# EAGLE design Sch_v6 (EAGLE 9.6.2)
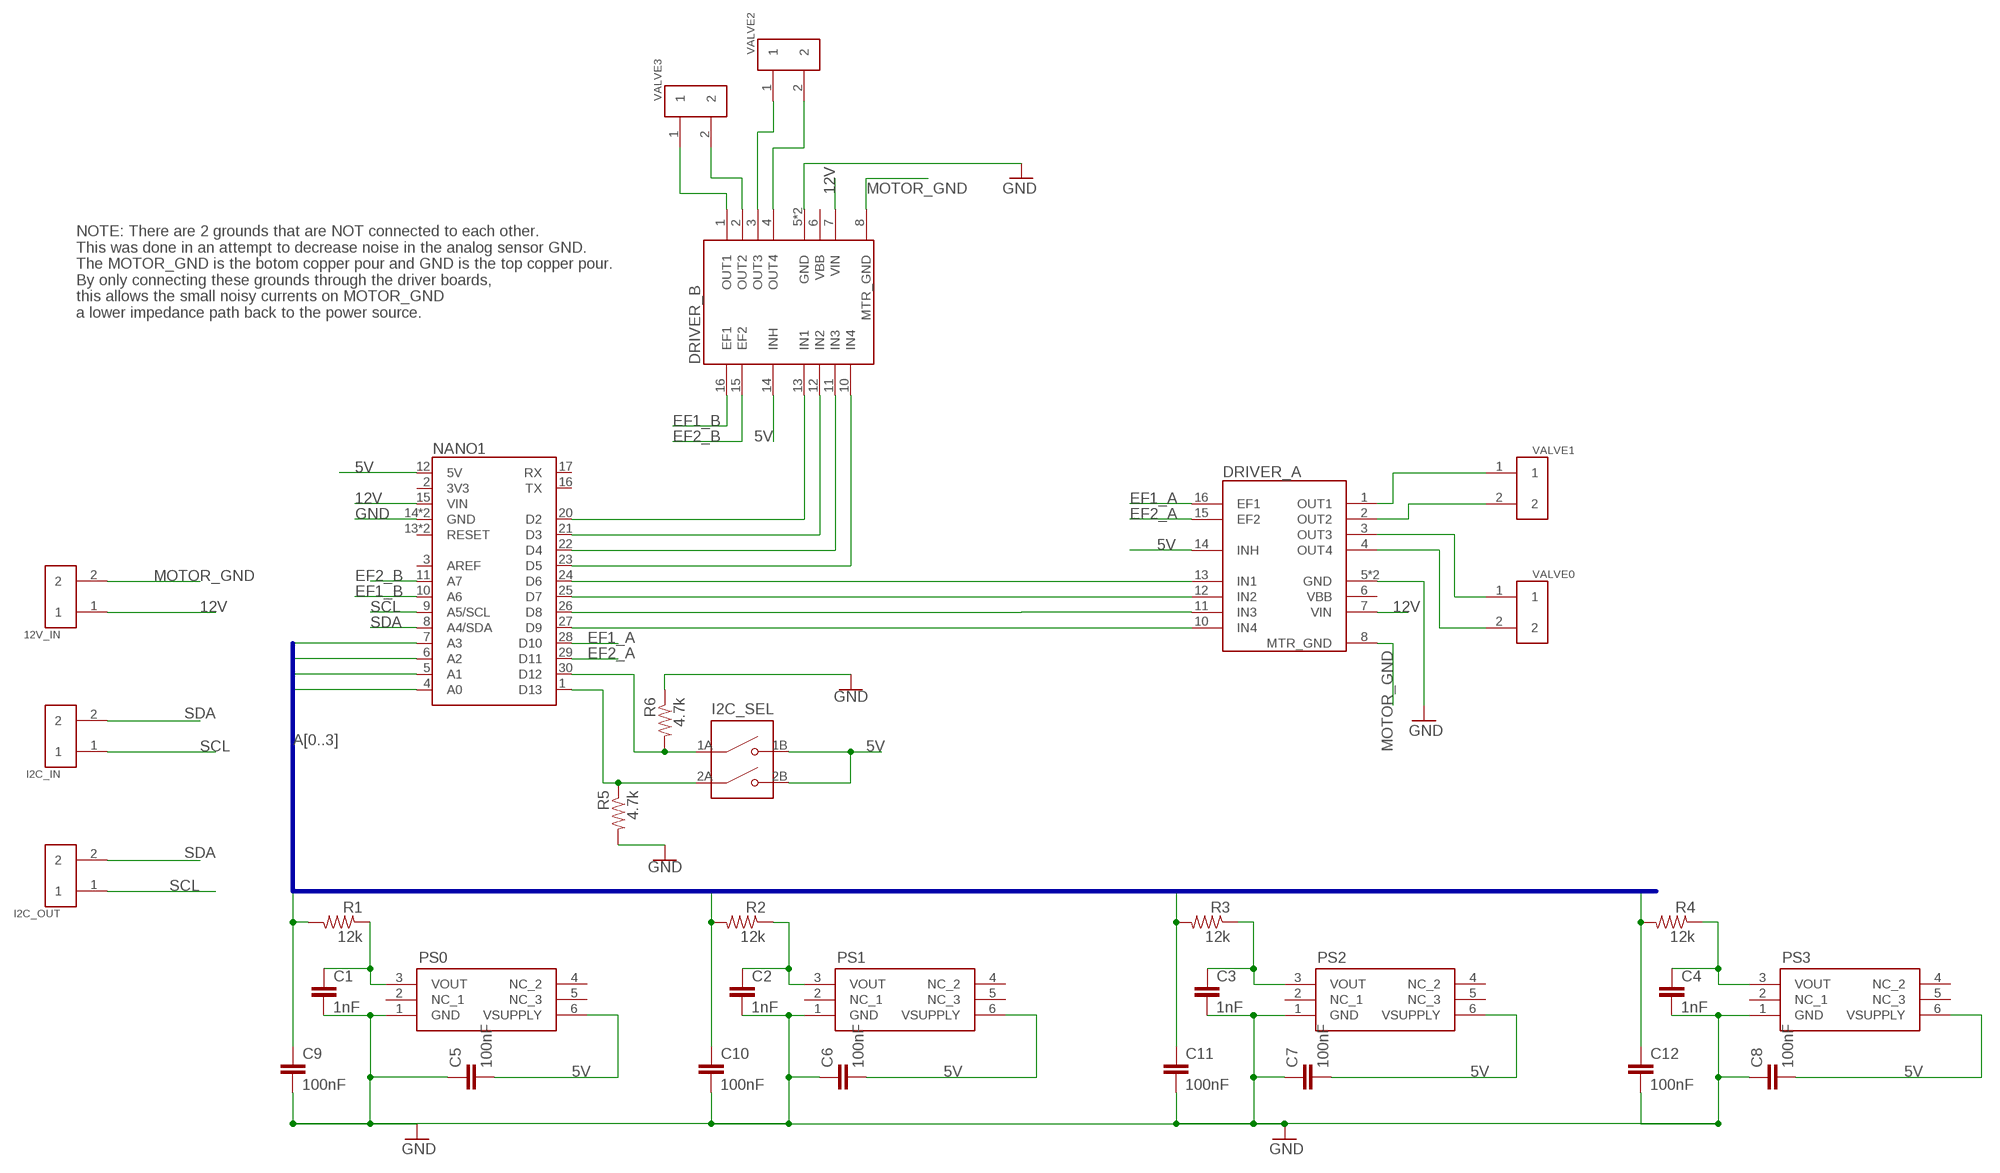
[diagram p0: schematic, sheet 1]

## Parts
12V_IN  PHOENIX_CONTACT_1759017  [PHOENIX_CONTACT_1759017]
C1  1nF  CERAMIC_CAPACITOR  [CERAMIC_CAPACITOR]
C2  1nF  CERAMIC_CAPACITOR  [CERAMIC_CAPACITOR]
C3  1nF  CERAMIC_CAPACITOR  [CERAMIC_CAPACITOR]
C4  1nF  CERAMIC_CAPACITOR  [CERAMIC_CAPACITOR]
C5  100nF  CERAMIC_CAPACITOR  [CERAMIC_CAPACITOR]
C6  100nF  CERAMIC_CAPACITOR  [CERAMIC_CAPACITOR]
C7  100nF  CERAMIC_CAPACITOR  [CERAMIC_CAPACITOR]
C8  100nF  CERAMIC_CAPACITOR  [CERAMIC_CAPACITOR]
C9  100nF  CERAMIC_CAPACITOR  [CERAMIC_CAPACITOR]
C10  100nF  CERAMIC_CAPACITOR  [CERAMIC_CAPACITOR]
C11  100nF  CERAMIC_CAPACITOR  [CERAMIC_CAPACITOR]
C12  100nF  CERAMIC_CAPACITOR  [CERAMIC_CAPACITOR]
DRIVER_A  A4990_DUAL_MOTOR_DRIVER_CARRIER  [A4990_DUAL_MOTOR_DRIVER_CARRIER]
DRIVER_B  A4990_DUAL_MOTOR_DRIVER_CARRIER  [A4990_DUAL_MOTOR_DRIVER_CARRIER]
I2C_IN  PHOENIX_CONTACT_1759017  [PHOENIX_CONTACT_1759017]
I2C_OUT  PHOENIX_CONTACT_1759017  [PHOENIX_CONTACT_1759017]
I2C_SEL  2PIN_DIP_DS01-254-S-02BE  [2PIN_DIP_DS01-254-S-02BE]
NANO1  ARDUINO_NANO_EVERY  [ARDUINO_NANO_EVERY]
PS0  PRESSURE_SENSOR_ABPDRNN100PGAA5  [PRESSURE_SENSOR_ABPDRNN100PGAA5]
PS1  PRESSURE_SENSOR_ABPDRNN100PGAA5  [PRESSURE_SENSOR_ABPDRNN100PGAA5]
PS2  PRESSURE_SENSOR_ABPDRNN100PGAA5  [PRESSURE_SENSOR_ABPDRNN100PGAA5]
PS3  PRESSURE_SENSOR_ABPDRNN100PGAA5  [PRESSURE_SENSOR_ABPDRNN100PGAA5]
R1  12k  R-US_0204/7  [0204/7]
R2  12k  R-US_0204/7  [0204/7]
R3  12k  R-US_0204/7  [0204/7]
R4  12k  R-US_0204/7  [0204/7]
R5  4.7k  R-US_0204/7  [0204/7]
R6  4.7k  R-US_0204/7  [0204/7]
VALVE0  PHOENIX_CONTACT_1759017  [PHOENIX_CONTACT_1759017]
VALVE1  PHOENIX_CONTACT_1759017  [PHOENIX_CONTACT_1759017]
VALVE2  PHOENIX_CONTACT_1759017  [PHOENIX_CONTACT_1759017]
VALVE3  PHOENIX_CONTACT_1759017  [PHOENIX_CONTACT_1759017]

## Nets
5V [Power]: C5.2 C6.2 C7.2 C8.2 DRIVER_A.14(INH) DRIVER_B.14(INH) I2C_SEL.1B(NO1) I2C_SEL.2B(NO2) NANO1.12(5V) PS0.6(VSUPPLY) PS1.6(VSUPPLY) PS2.6(VSUPPLY) PS3.6(VSUPPLY)
12V [Motor Power]: 12V_IN.1 DRIVER_A.7(VIN) DRIVER_B.7(VIN) NANO1.15(VIN)
A0 [Analog Signal]: C9.1 NANO1.4(A0) R1.2
A1 [Analog Signal]: C10.1 NANO1.5(A1) R2.2
A2 [Analog Signal]: C11.1 NANO1.6(A2) R3.2
A3 [Analog Signal]: C12.1 NANO1.7(A3) R4.2
D2: DRIVER_B.13(IN1) NANO1.20(D2)
D3: DRIVER_B.12(IN2) NANO1.21(D3)
D4: DRIVER_B.11(IN3) NANO1.22(D4)
D5: DRIVER_B.10(IN4) NANO1.23(D5)
D6: DRIVER_A.13(IN1) NANO1.24(D6)
D7: DRIVER_A.12(IN2) NANO1.25(D7)
D8: DRIVER_A.11(IN3) NANO1.26(D8)
D9: DRIVER_A.10(IN4) NANO1.27(D9)
EF1_A: DRIVER_A.16(EF1) NANO1.28(D10)
EF1_B: DRIVER_B.16(EF1) NANO1.10(A6)
EF2_A: DRIVER_A.15(EF2) NANO1.29(D11)
EF2_B: DRIVER_B.15(EF2) NANO1.11(A7)
GND: C1.2 C2.2 C3.2 C4.2 C5.1 C6.1 C7.1 C8.1 C9.2 C10.2 C11.2 C12.2 DRIVER_A.5(GND) DRIVER_A.9(GND) DRIVER_B.5(GND) DRIVER_B.9(GND) NANO1.14(GND) NANO1.19(GND) PS0.1(GND) PS1.1(GND) PS2.1(GND) PS3.1(GND) R5.2 R6.1
MOTOR_GND: 12V_IN.2 DRIVER_A.8(MTR_GND) DRIVER_B.8(MTR_GND)
N$1: C1.1 PS0.3(VOUT) R1.1
N$2: C2.1 PS1.3(VOUT) R2.1
N$3: C3.1 PS2.3(VOUT) R3.1
N$4: C4.1 PS3.3(VOUT) R4.1
N$5 [Valve Power]: DRIVER_A.2(OUT2) VALVE1.2
N$6 [Valve Power]: DRIVER_A.1(OUT1) VALVE1.1
N$7 [Valve Power]: DRIVER_A.3(OUT3) VALVE0.1
N$8 [Valve Power]: DRIVER_A.4(OUT4) VALVE0.2
N$9 [Valve Power]: DRIVER_B.1(OUT1) VALVE3.1
N$10 [Valve Power]: DRIVER_B.2(OUT2) VALVE3.2
N$11 [Valve Power]: DRIVER_B.3(OUT3) VALVE2.1
N$12 [Valve Power]: DRIVER_B.4(OUT4) VALVE2.2
N$13: I2C_SEL.1A(COM1) NANO1.30(D12) R6.2
N$14: I2C_SEL.2A(COM2) NANO1.1(D13) R5.1
SCL [I2C Bus]: I2C_IN.1 I2C_OUT.1 NANO1.9(A5/SCL)
SDA [I2C Bus]: I2C_IN.2 I2C_OUT.2 NANO1.8(A4/SDA)
Unconnected: DRIVER_A.6(VBB) DRIVER_B.6(VBB) NANO1.2(3V3) NANO1.3(AREF) NANO1.13(RESET) NANO1.16(TX) NANO1.17(RX) NANO1.18(RESET) PS0.2(NC_1) PS0.4(NC_2) PS0.5(NC_3) PS1.2(NC_1) PS1.4(NC_2) PS1.5(NC_3) PS2.2(NC_1) PS2.4(NC_2) PS2.5(NC_3) PS3.2(NC_1) PS3.4(NC_2) PS3.5(NC_3)

## Buses
A[0..3]

## Notes on the sheet
- NOTE: There are 2 grounds that are NOT connected to each other.
  This was done in an attempt to decrease noise in the analog sensor GND.
  The MOTOR_GND is the botom copper pour and GND is the top copper pour. 
  By only connecting these grounds through the driver boards,
  this allows the small noisy currents on MOTOR_GND 
  a lower impedance path back to the power source.

## Library data of the parts
12V_IN I2C_IN I2C_OUT VALVE0 VALVE1-VALVE3 = byu_pressure_control:PHOENIX_CONTACT_1759017
C1-C12 = byu_pressure_control:CERAMIC_CAPACITOR: Ceramic capacitors A capacitor is a passive two-terminal electrical component used to store electrical energy temporarily in an electric field.
DRIVER_A DRIVER_B = byu_pressure_control:A4990_DUAL_MOTOR_DRIVER_CARRIER: A4990 Dual Motor Driver Carrier (Pololu) Link <https://www.pololu.com/product/2137> Important Note: The schematic for this part indicates that there is a GND and MTR_GND (Motor ground) that are separate. This is not actually the case on the real board where all of the ground pins are connected to each other. They were separated out here to enable each GND and MTR_GND to be connected to different ground pours on the PCB to minimize noise on the analog sensors which will use the GND plane. Once these driver boards are plugged into the PCB, they connect the ground pours to each other to ensure one common ground in the pcb.
I2C_SEL = byu_pressure_control:2PIN_DIP_DS01-254-S-02BE; CUI_PURCHASE_URL: https://www.cuidevices.com/product/switches/dip-switches/ds01-254-series?utm_source=snapeda.com&utm_medium=referral&utm_campaign=snapedaBOM; DESCRIPTION: 2 Position, Through Hole, 2.54 mm Pitch, Raised Slide Actuator, Flat Bottom, Short Pin, DIP Switch; DIGI-KEY_PART_NUMBER: 2223-DS01-254-S-02BE-ND; MF: CUI Devices; MP: DS01-254-S-02BE; PACKAGE: None; PURCHASE-URL: https://pricing.snapeda.com/search/part/DS01-254-S-02BE/?ref=eda
NANO1 = byu_pressure_control:ARDUINO_NANO_EVERY: Arduino Nano Every Website <https://store.arduino.cc/usa/nano-every> The Nano Every is Arduino’s 5V compatible board in the smallest available form factor: 45x18mm! The Arduino Nano is the preferred board for many projects requiring a small and easy to use microcontroller board. The small footprint and low price, make the Nano Every particularly suited for wearable inventions, low-cost robotics, electronic musical instruments, and general use to control smaller parts of larger projects. The Arduino Nano Every is an evolution of the traditional Arduino Nano board but features a lot more powerful processor, the ATMega4809. This will allow you to make larger programs than with the Arduino Uno (it has 50% more program memory), and with a lot more variables (the RAM is 200% bigger).; WEBSITE: https://store.arduino.cc/usa/nano-every
PS0 PS1-PS3 = byu_pressure_control:PRESSURE_SENSOR_ABPDRNN100PGAA5: Honeywell Pressure Sensor (ABPDRNN100PGAA5) Link <https://www.mouser.com/ProductDetail/Honeywell/ABPDRNN100PGAA5?qs=sGAEpiMZZMvhQj7WZhFIAD2P7qVC0dZ7tI11ZYAVyGqQk%2FMhVJdgGw%3D%3D>; DESCRIPTION: Board Mount Pressure Sensors BASIC PRESSURE SENSOR; HEIGHT: 7.61mm; MANUFACTURER_NAME: Honeywell; MANUFACTURER_PART_NUMBER: ABPDRNN100PGAA5; MOUSER_PART_NUMBER: 785-ABPDRNN100PGAA5; MOUSER_PRICE-STOCK: https://www.mouser.co.uk/ProductDetail/Honeywell/ABPDRNN100PGAA5?qs=YCa%2FAAYMW03EAlFoRyu6VA%3D%3D
R1-R6 = rcl:R-US_: RESISTOR, American symbol; SPICEPREFIX: R

## Net classes
1 Power: width 0.305 mm, drill 0.305 mm
2 Motor Power: width 2.032 mm, drill 2.032 mm, clearance 0.508 mm to class 0
3 Analog Signal: clearance 0.762 mm to class 2, clearance 0.127 mm
4 I2C Bus: clearance 0.762 mm to class 2, clearance 0.254 mm to class 3
5 Valve Power: width 0.762 mm, drill 0.762 mm, clearance 0.508 mm to class 3, clearance 0.508 mm to class 4

## Board
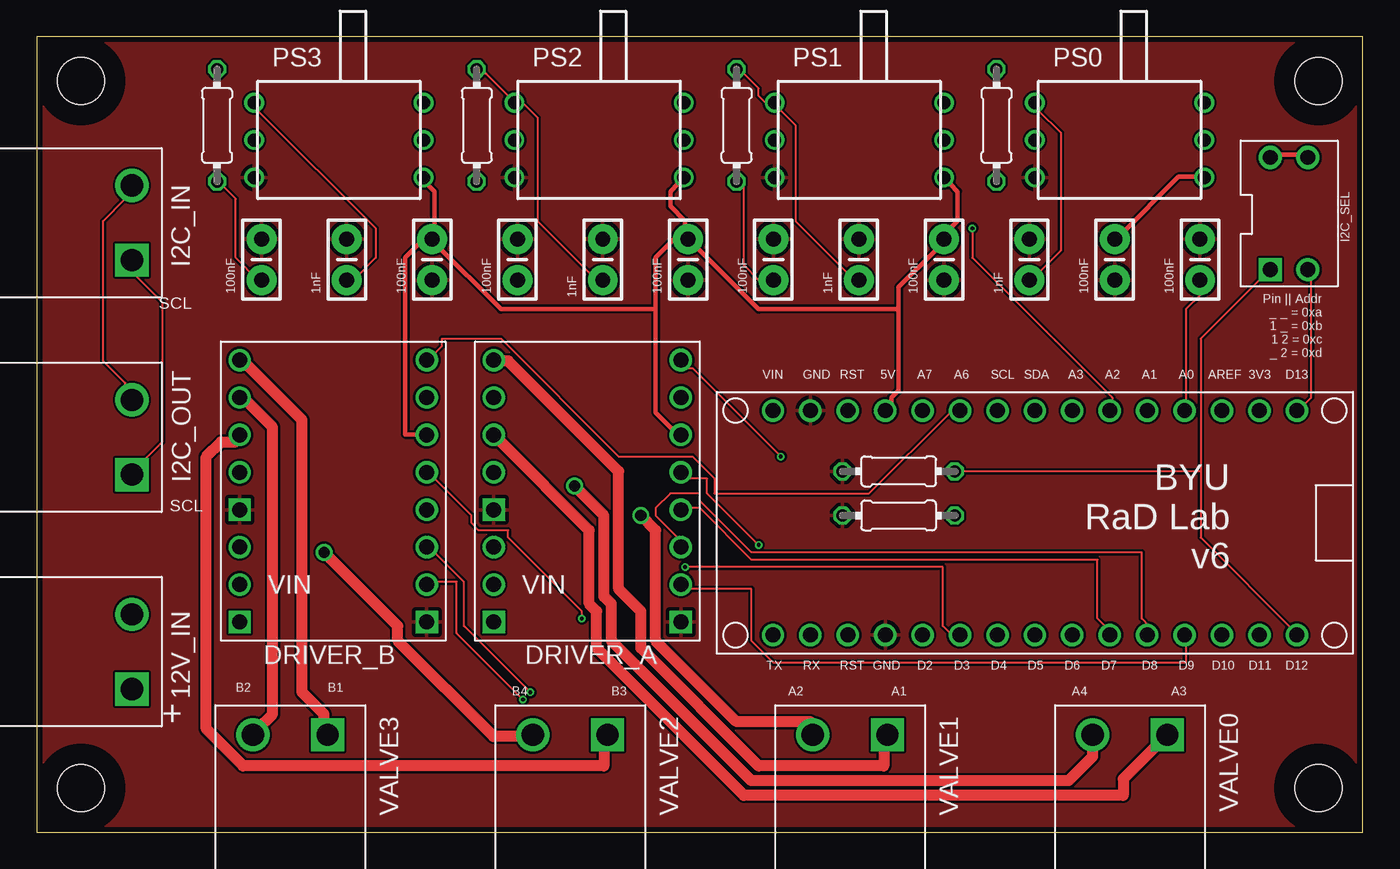
[diagram p1: board, top side]
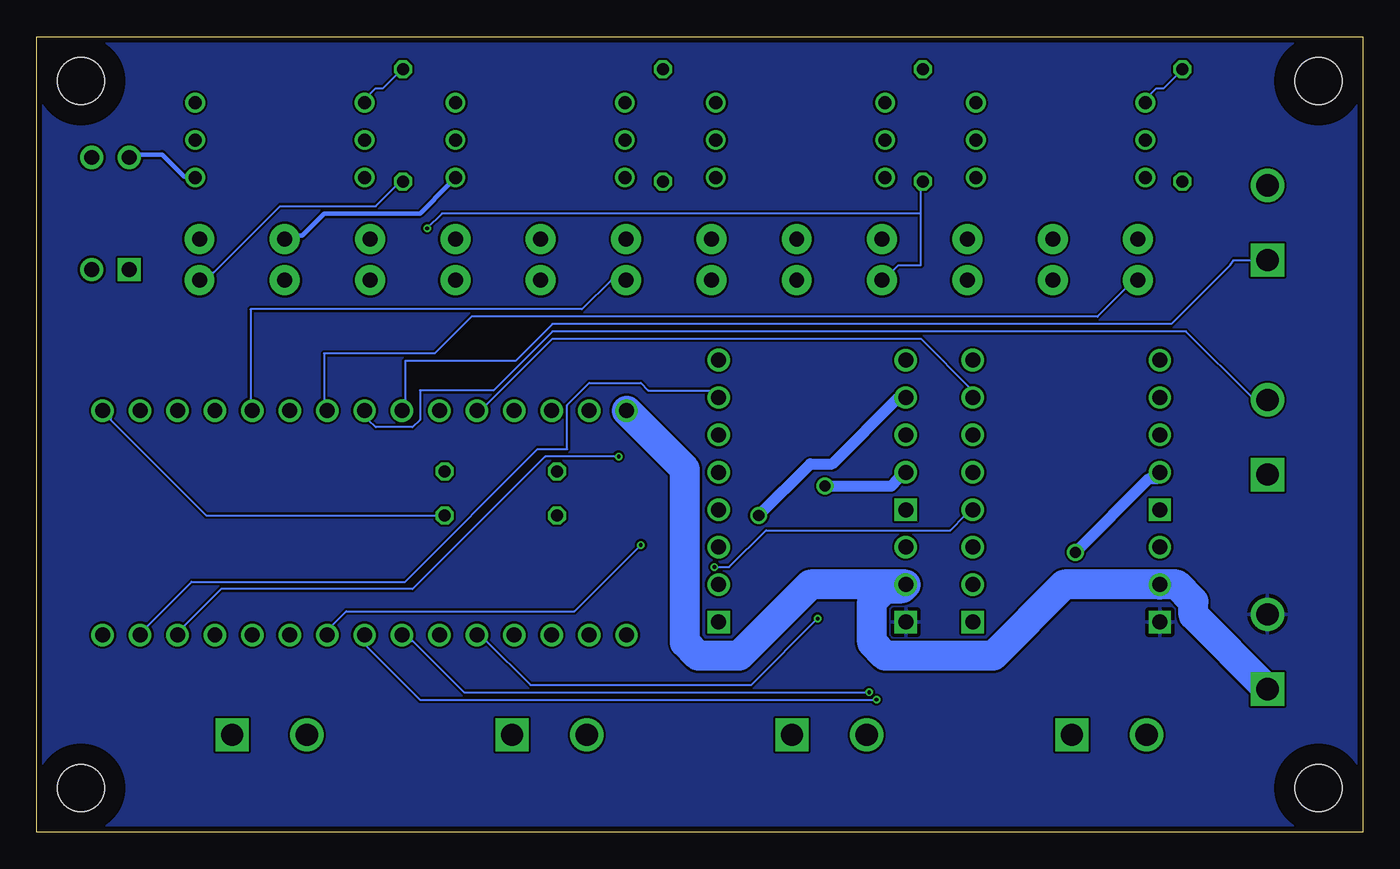
[diagram p2: board, bottom side, seen from below]

Size 90 x 54 mm. Coordinates in mm from the lower left corner, seen from the top.
Outline: 0,54 0,0 90,0 90,54 0,54
Copper layers (1*16): Top 0.035559375mm / dielectric 1.6mm / Bottom 0.035559375mm
Design rules "oshpark-2layer": minimum track width 6mil, minimum drill 10mil, track to track 6mil, track to pad 6mil, pad to pad 6mil, via to via 6mil, smd to smd 6mil, copper to edge 15mil, drill to drill 6mil, minimum pad ring 5mil, minimum via ring 5mil, stop-mask expansion 2.5mil, vias tented up to drill 0mil, thermal gap 10mil
Holes 3.2 mm at 3,51 3,3 87,51 87,3
tKeepout: area 0,48 to 6,54; area 0,0 to 6,6; area 84,48 to 90,54; area 84,0 to 90,6
bKeepout: area 0,48 to 6,54; area 0,0 to 6,6; area 84,48 to 90,54; area 84,0 to 90,6
tRestrict: area 0,48 to 6,54; area 0,0 to 6,6; area 84,48 to 90,54; area 84,0 to 90,6
bRestrict: area 0,48 to 6,54; area 0,0 to 6,6; area 84,48 to 90,54; area 84,0 to 90,6
vRestrict: area 0,48 to 6,54; area 0,0 to 6,6; area 84,48 to 90,54; area 84,0 to 90,6

### Footprints (pad centres in the part's own frame; a part is rotated, then mirrored left to right if it is on the bottom)
PHOENIX_CONTACT_1759017 = drill 1.5 square: 1 -2.54,-4 | drill 1.5: 2 2.54,-4
CERAMIC_CAPACITOR = drill 1.016 pad 2.032: 1 -1.397,0; 2 1.397,0
A4990_DUAL_MOTOR_DRIVER_CARRIER = drill 1.016: 1 1.27,19.05; 2 1.27,16.51; 3 1.27,13.97; 4 1.27,11.43; 6 1.27,6.35; 7 1.27,3.81; 10 13.97,3.81; 11 13.97,6.35; 12 13.97,8.89; 13 13.97,11.43; 14 13.97,13.97; 15 13.97,16.51 | drill 1.016 square: 5 1.27,8.89; 8 1.27,1.27; 9 13.97,1.27 | drill 1.026: 16 13.97,19.05
2PIN_DIP_DS01-254-S-02BE = drill 1 pad 1.58 square: 1A -1.27,-3.81 | drill 1 pad 1.58: 1B -1.27,3.81; 2A 1.27,-3.81; 2B 1.27,3.81
ARDUINO_NANO_EVERY = drill 1.016: 1 -7.62,17.78; 2 -7.62,15.24; 3 -7.62,12.7; 4 -7.62,10.16; 5 -7.62,7.62; 6 -7.62,5.08; 7 -7.62,2.54; 8 -7.62,0; 9 -7.62,-2.54; 10 -7.62,-5.08; 11 -7.62,-7.62; 12 -7.62,-10.16; 13 -7.62,-12.7; 14 -7.62,-15.24; 15 -7.62,-17.78; 16 7.62,-17.78; 17 7.62,-15.24; 18 7.62,-12.7; 19 7.62,-10.16; 20 7.62,-7.62; 21 7.62,-5.08; 22 7.62,-2.54; 23 7.62,0; 24 7.62,2.54; 25 7.62,5.08; 26 7.62,7.62; 27 7.62,10.16; 28 7.62,12.7; 29 7.62,15.24; 30 7.62,17.78
PRESSURE_SENSOR_ABPDRNN100PGAA5 = drill 0.889: 1 6.55,-0.25; 2 4.01,-0.25; 3 1.47,-0.25; 4 1.47,11.25; 5 4.01,11.25; 6 6.55,11.25
0204/7 = drill 0.813 octagon: 1 -3.81,0; 2 3.81,0

### Placement (x,y rotation side)
12V_IN  2.46,12.25 90 top
C1  67.38,38.88 90 top
C2  55.79,38.88 90 top
C3  38.42,38.88 90 top
C4  21.04,38.88 90 top
C5  26.83,38.88 90 top
C6  44.21,38.88 90 top
C7  73.17,38.88 90 top
C8  61.59,38.88 90 top
C9  78.96,38.88 90 top
C10  50,38.88 90 top
C11  32.63,38.88 90 top
C12  15.25,38.88 90 top
DRIVER_A  29.75,13 0 top
DRIVER_B  12.5,13 0 top
I2C_IN  2.46,41.38 90 top
I2C_OUT  2.46,26.81 90 top
I2C_SEL  85,42 0 top
NANO1  67.75,21 270 top
PS0  68,51 270 top
PS1  50.33,51 270 top
PS2  32.67,51 270 top
PS3  15,51 270 top
R1  65.14,47.99 270 top
R2  47.5,47.99 270 top
R3  29.87,47.99 270 top
R4  12.23,47.99 270 top
R5  58.5,21.5 180 top
R6  58.5,24.5 0 top
VALVE0  74.21,2.61 180 top
VALVE1  55.21,2.61 180 top
VALVE2  36.21,2.61 180 top
VALVE3  17.21,2.61 180 top

### Tracks (layer width: path | path; a pad name or v marks a point on that pad's centre or on a via)
5V
  Top 0.305: PS3.6 26.5,44 27,43.5 27,40.5 C5.2 | DRIVER_B.14 26,27 25,27 25,39 26.5,40.5 C5.2 | 44,41 44,40.5 C6.2 | 44,41 44,41.5 43,42.5 43,43.5 43.5,44 PS2.6 | 42,35.5 42,39 44,41 | 42,35.5 42,28.5 43.5,27 DRIVER_A.14 | 44,41 C6.2 | 42,35.5 31.5,35.5 27,40 C5.2 | PS1.6 62,44 62.5,43.5 62.5,41.5 62,41 62,40.5 C8.2 61.5,40 61.5,39.5 61,39.5 58.5,37 58.5,35.5 | 58.5,35.5 58.5,30 58,29.5 58,29 NANO1.12 | I2C_SEL.2B 86,46 84,46 I2C_SEL.1B | C7.2 73.5,40.5 77.5,44.5 79,44.5 PS0.6 | 58.5,35.5 49,35.5 44.5,40 C6.2
  Bottom 0.305: PS0.6 79.5,44.5 80,44.5 81.5,46 83.5,46 I2C_SEL.1B | PS1.6 62,44 64,42 70.5,42 72,40.5 73,40.5 C7.2
12V
  Bottom 2.032: 12V_IN.1 11.48,14.73 11.48,15.66 12.63,16.81 DRIVER_B.7 20.25,16.81 25.08,11.98 32.41,11.98 33.31,12.88 33.31,15.66 32.41,16.56 31.27,16.56 DRIVER_A.7 37.5,16.81 42.33,11.98 45.11,11.98 46.01,12.88 46.01,24.66 NANO1.15
A0
  Top 0.152: NANO1.4 78,29 78,35.5 79,36.5 79,37 C9.1
  Bottom 0.152: R1.2 65.5,44 67,42.5 73.5,42.5 78,38 78.5,38 79,37.5 C9.1
A1
  Top 0.152: R2.2 48,44 48,38.5 49,37.5 50,37.5 C10.1
  Bottom 0.152: NANO1.5 75.5,29 75.5,35.5 53,35.5 51,37.5 50.5,37.5 C10.1
A2  (via drill 0.25)
  Top 0.152: v63.5,41 63.5,39 73,29.5 73,29 NANO1.6
  Bottom 0.152: 30,42 30,38.5 31.5,38.5 32.5,37.5 C11.1 | 30,42 30,44 R3.2 | v63.5,41 62.5,42 30,42
A3
  Top 0.152: R4.2 12.5,44 13.5,43 13.5,39 15,37.5 C12.1
  Bottom 0.152: NANO1.7 70.5,29 70.5,32.5 63,32.5 60.5,35 18,35 16,37 15.5,37 C12.1
D2  (via drill 0.25)
  Top 0.152: v37,14.5 37,15 32,20 32,20.5 30,20.5 29.5,21 29.5,21.5 27,24 26.5,24 DRIVER_B.13
  Bottom 0.152: v37,14.5 41.5,10 56.5,10 59.5,13 59.5,13.5 60,13.5 NANO1.20
D3  (via drill 0.25)
  Top 0.152: v44,18 61.5,18 61.5,14 62.5,13 NANO1.21
  Bottom 0.152: v44,18 43,18 40.5,20.5 28,20.5 27,21.5 26.5,21.5 DRIVER_B.12
D4  (via drill 0.25)
  Top 0.152: v33.5,9.5 29,14 29,17 27,19 26.5,19 DRIVER_B.11
  Bottom 0.152: v33.5,9.5 61,9.5 64.5,13 65,13 NANO1.22
D5  (via drill 0.25)
  Top 0.152: v33,9 28.5,13.5 28.5,17 26.5,17 DRIVER_B.10
  Bottom 0.152: v33,9 64,9 68,13 NANO1.23
D6  (via drill 0.25)
  Top 0.152: v49,19.5 45.5,23 45.5,24 44,24 DRIVER_A.13
  Bottom 0.152: v49,19.5 53.5,15 69,15 70.5,13.5 NANO1.24
D7
  Top 0.152: DRIVER_A.12 44,22 45,22 48.5,18.5 72,18.5 72,14.5 72.5,14 72.5,13.5 NANO1.25
D8
  Top 0.152: DRIVER_A.11 43.5,19.5 43.5,20 42,21.5 42,22 43,23 45,23 45,22.5 48.5,19 75,19 75,14.5 75.5,14 75.5,13.5 NANO1.26
D9
  Top 0.152: DRIVER_A.10 44,16.5 48.5,16.5 48.5,13 50,11.5 78,11.5 78,13 NANO1.27
EF1_A  (via drill 0.25)
  Top 0.152: v50.5,25.5 44.5,31.5 44,31.5 44,32 DRIVER_A.16
  Bottom 0.152: v50.5,25.5 55.5,25.5 64.5,16.5 77.5,16.5 80,14 80,13.5 NANO1.28
EF1_B
  Top 0.152: NANO1.10 62.5,28.5 62,28.5 56.5,23 46,23 46,24 44.5,25.5 39.5,25.5 31.5,33.5 27.5,33.5 27.5,33 26.5,32 DRIVER_B.16
EF2_A
  Bottom 0.152: DRIVER_A.15 44,30 48.5,30 49,30.5 52.5,30.5 54,29 54,26 56,26 65,17 79.5,17 83,13.5 NANO1.29
EF2_B
  Bottom 0.152: DRIVER_B.15 26.5,30 30,33.5 55,33.5 59.5,29 59.5,28.5 60,28.5 NANO1.11
GND
  pour Top: 0,54 0,0 90,0 90,54
  pour Top: 0,54 90,54 90,0 0,0
MOTOR_GND
  pour Bottom: 0,54 0,0 90,0 90,54
  pour Bottom: 0,54 0,0 90,0 90,54
N$1
  Top 0.152: C1.1 67.5,37.5 69.5,39.5 69.5,47.5 68,49 68,49.5 PS0.3
  Bottom 0.152: R1.1 65.5,51.5 66.5,50.5 67,50.5 67.5,50 PS0.3
N$2
  Top 0.152: 50,49.5 49.5,49.5 49,50 49,50.5 48,51.5 R2.1 | 50,49.5 50,49 50.5,49 51.5,48 51.5,41.5 55.5,37.5 C2.1 | 50,49.5 PS1.3
N$3
  Top 0.152: R3.1 30,51.5 30.5,51.5 32,50 PS2.3 32.5,50 34,48.5 34,41.5 38,37.5 C3.1
N$4
  Top 0.152: C4.1 21.5,37.5 23,39 23,41 15,49 15,49.5 PS3.3
  Bottom 0.152: R4.1 12.5,51.5 13.5,50.5 14,50.5 14.5,50 PS3.3
N$5  (via drill 0.76)
  Top 0.762: v41,21.5 42,20.5 42,13 47.5,7.5 52.5,7.5 52.67,7.11 VALVE1.2
  Bottom 0.762: v41,21.5 37.5,25 36,25 31.5,29.5 DRIVER_A.2
N$6
  Top 0.762: DRIVER_A.1 31.5,32 32,32 39.5,24.5 39.5,16.5 41,15 41,12.5 49,4.5 57.5,4.5 57.5,6.5 VALVE1.1
N$7
  Top 0.762: VALVE0.1 73.75,3.61 73.75,2.5 48,2.5 38,12.5 38,15 37.5,15.5 37.5,20.5 31.5,26.5 DRIVER_A.3
N$8  (via drill 0.76)
  Top 0.762: v36.5,23.5 38.5,21.5 38.5,16 39,15.5 39,13 48.5,3.5 70.03,3.5 71.67,5.14 VALVE0.2
  Bottom 0.762: v36.5,23.5 32,23.5 31.5,24 DRIVER_A.4
N$9
  Top 0.762: DRIVER_B.1 14,32 18,28 18,9.5 19.5,8 19.5,7 VALVE3.1
N$10
  Top 0.762: DRIVER_B.2 14,29.5 16,27.5 16,8 15,7 VALVE3.2
N$11
  Top 0.762: DRIVER_B.3 13.5,26.5 12.5,26.5 11.5,25.5 11.5,7 14,4.5 38.5,4.5 38.5,6.5 VALVE2.1
N$12  (via drill 0.76)
  Top 0.762: v19.5,19 24.5,14 24.5,13 31,6.5 33.5,6.5 VALVE2.2
  Bottom 0.762: v19.5,19 14.5,24 14,24 DRIVER_B.4
N$13
  Top 0.152: 79,24.5 R6.2 | 79,24.5 79,33.5 83.5,38 I2C_SEL.1A | 79,24.5 79,20 85.5,13.5 NANO1.30
N$14
  Top 0.152: I2C_SEL.2A 86.5,38 86.5,29.5 86,29 NANO1.1
  Bottom 0.152: R5.1 78.5,21.5 85,28 85,28.5 85.5,28.5 NANO1.1
SCL
  Top 0.152: I2C_OUT.1 6.5,24.5 8.5,26.5 8.5,36 6.5,38 6.5,38.5 I2C_IN.1
  Bottom 0.152: NANO1.9 65,29 65,32 57.5,32 55,34.5 13,34.5 9,38.5 8.76,38.84 I2C_IN.1
SDA
  Top 0.152: I2C_IN.2 6,43.5 6,43 4.5,41.5 4.5,32 6,30.5 6,29.5 I2C_OUT.2
  Bottom 0.152: NANO1.8 67.5,28.5 67.5,28 67,27.5 64.5,27.5 64,28 64,30 59,30 55,34 12,34 7.5,29.5 6.5,29.5 I2C_OUT.2

### Text on the board
tPlace: SCL | Pin || Addr / _ _ = 0xa / 1 _ = 0xb / 1 2 = 0xc / _ 2 = 0xd | VIN | GND | RST | 5V | A7 | A6 | SCL | SDA | A3 | A2 | A1 | A0 | AREF | 3V3 | D13 | BYU / RaD Lab / v6 | SCL | TX | RX | RST | GND | D2 | D3 | D4 | D5 | D6 | D7 | D8 | D9 | D10 | D11 | D12 | B2 | B1 | B4 | B3 | A2 | A1 | A4 | A3 | +